# Altium project ADCS C2Sv0.1 - Processor.PrjPcb
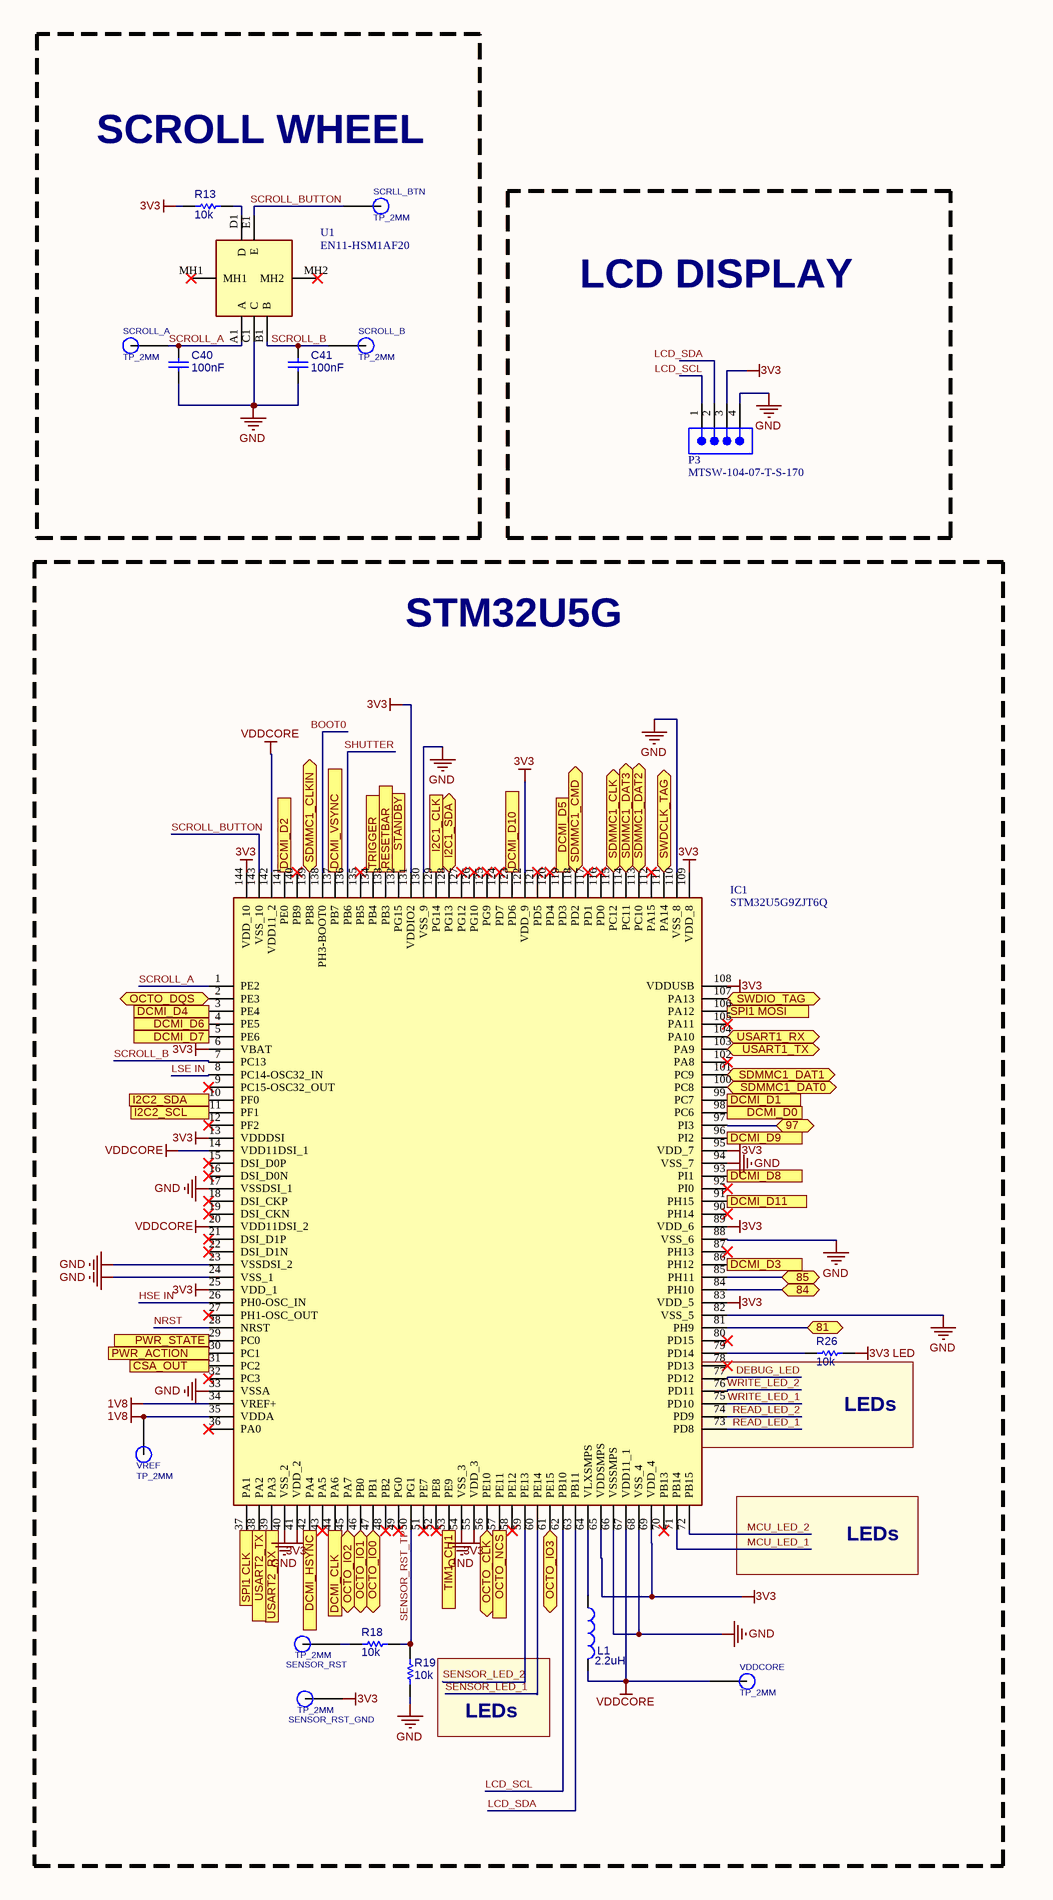
[diagram p0: MCU.SchDoc, left]
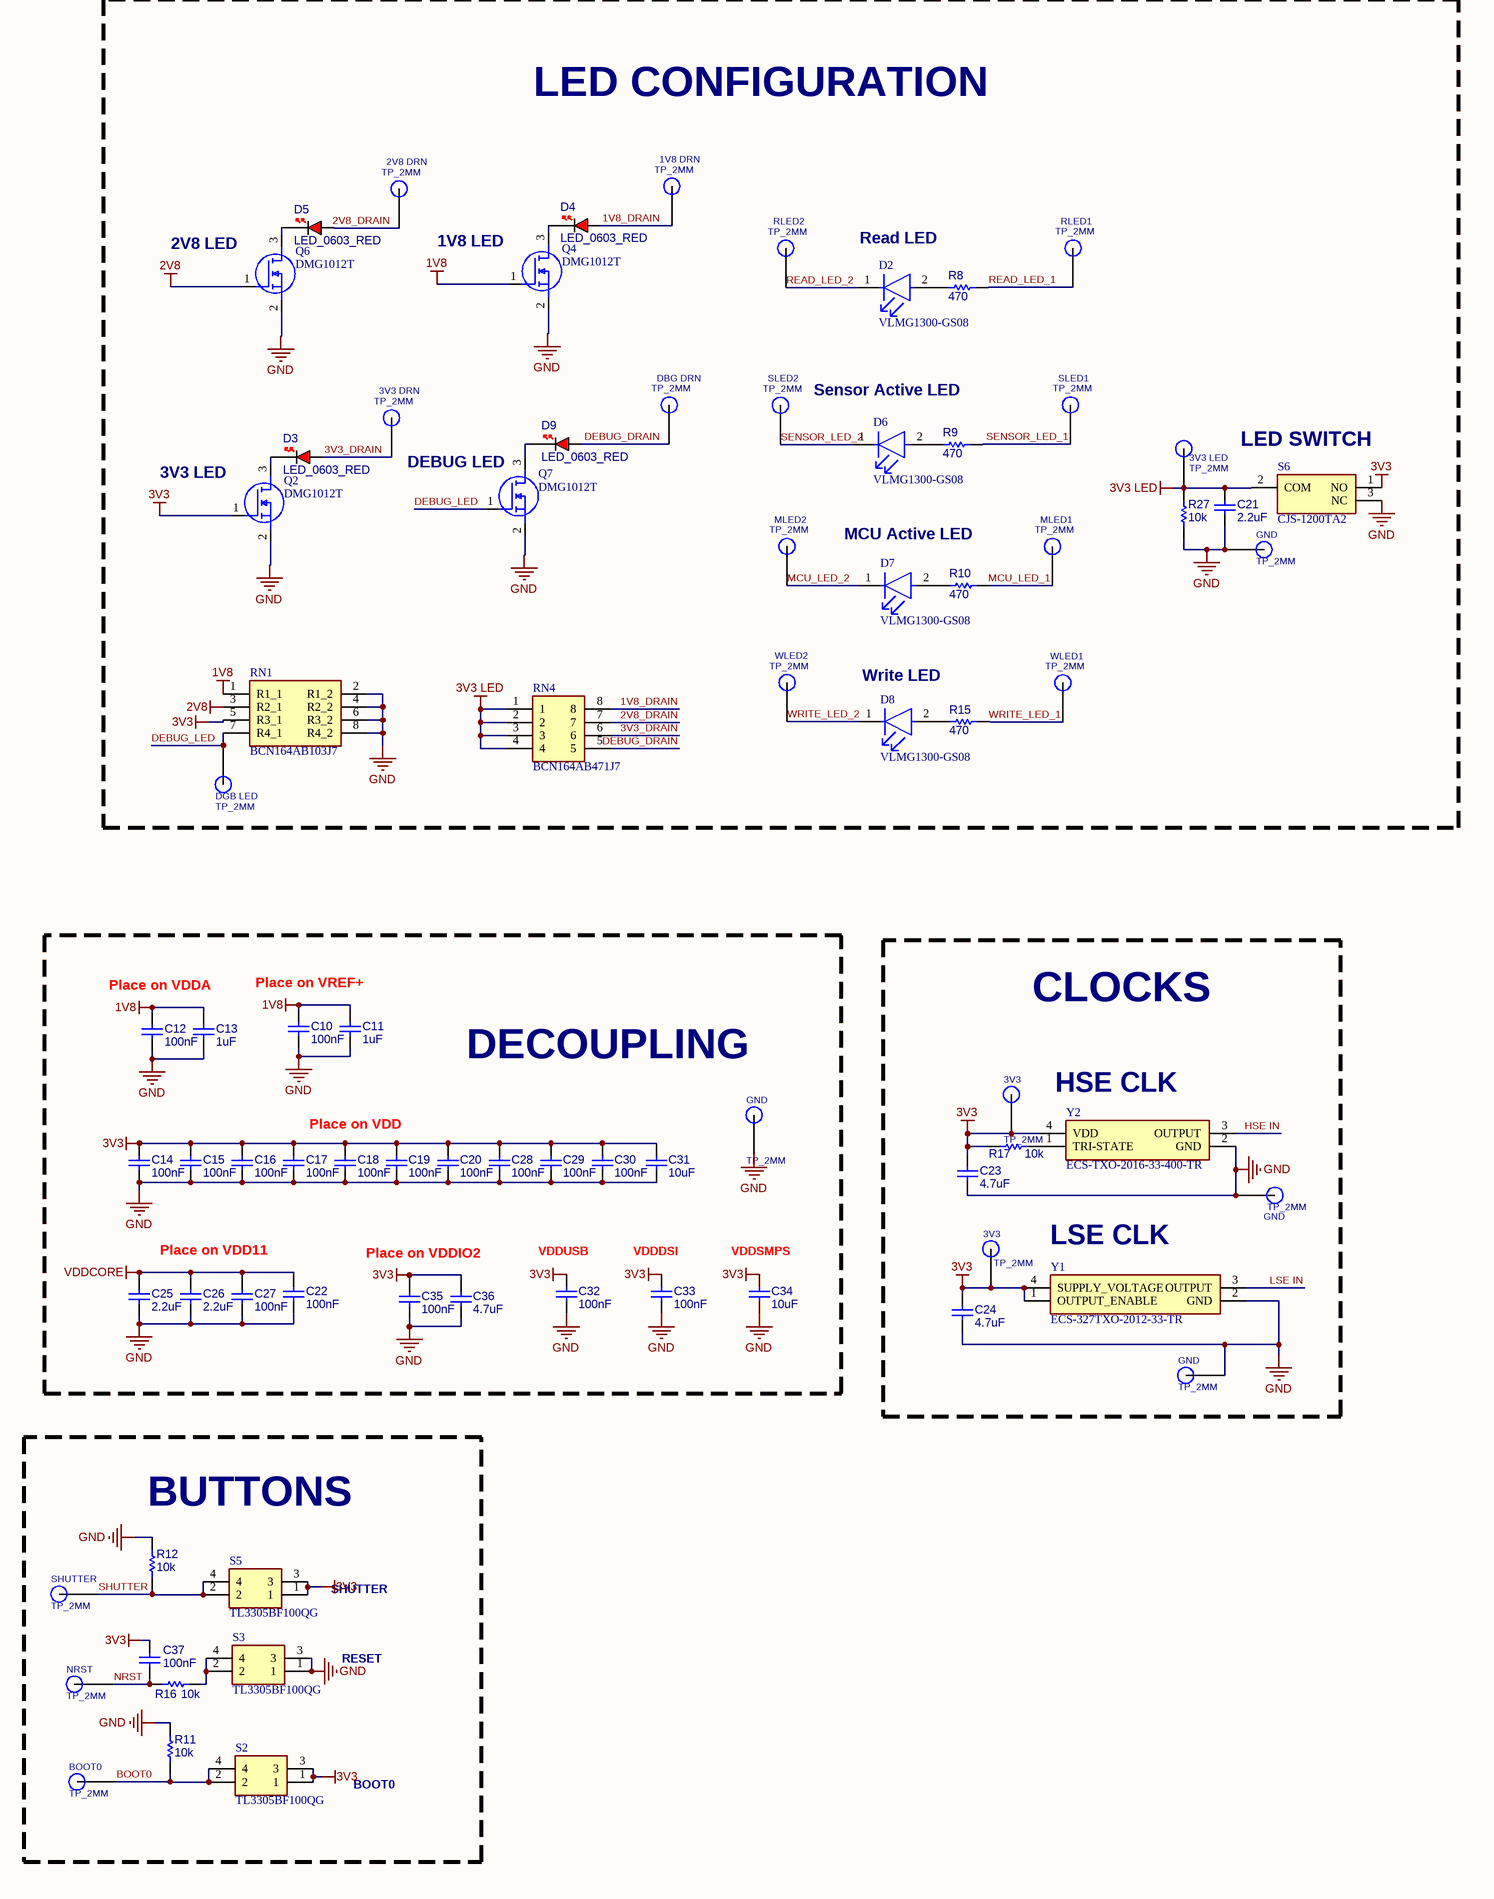
[diagram p1: MCU.SchDoc, right]
3 sheets, 102 parts. Net scope: flat (ports and power ports of the same name join across sheets).
Board file: ADCS C2Sv0.1.PcbDoc
Sheets:
  MCU.SchDoc
  Memory.SchDoc
  TAG.SchDoc

## Sheet MCU.SchDoc
size A2; SheetNumber: 2; SheetTotal: 7

### Parts
(Parts that share a designator on the sheet are numbered #1, #2 ... from top to bottom, then left to right.)
1V8_DRN  TP_2MM  [TESTPOINT 2MM]
2V8_DRN  TP_2MM  [TESTPOINT 2MM]
3V3#1  TP_2MM  [TESTPOINT 2MM]
3V3#2  TP_2MM  [TESTPOINT 2MM]
3V3_DRN  TP_2MM  [TESTPOINT 2MM]
3V3_LED  TP_2MM  [TESTPOINT 2MM]
BOOT0  TP_2MM  [TESTPOINT 2MM]
C10  value 100nF  [C0603]  (hidden comment: MCD-00237)
C11  value 1uF  [C0603]  (hidden comment: MCD-00237)
C12  value 100nF  [C0603]  (hidden comment: MCD-00237)
C13  value 1uF  [C0603]  (hidden comment: MCD-00237)
C14  value 100nF  [C0603]  (hidden comment: MCD-00237)
C15  value 100nF  [C0603]  (hidden comment: MCD-00237)
C16  value 100nF  [C0603]  (hidden comment: MCD-00237)
C17  value 100nF  [C0603]  (hidden comment: MCD-00237)
C18  value 100nF  [C0603]  (hidden comment: MCD-00237)
C19  value 100nF  [C0603]  (hidden comment: MCD-00237)
C20  value 100nF  [C0603]  (hidden comment: MCD-00237)
C21  value 2.2uF  [C0603]  (hidden comment: MCD-00237)
C22  value 100nF  [C0603]  (hidden comment: MCD-00237)
C23  value 4.7uF  [C0603]  (hidden comment: MCD-00237)
C24  value 4.7uF  [C0603]  (hidden comment: MCD-00237)
C25  value 2.2uF  [C0603]  (hidden comment: MCD-00237)
C26  value 2.2uF  [C0603]  (hidden comment: MCD-00237)
C27  value 100nF  [C0603]  (hidden comment: MCD-00237)
C28  value 100nF  [C0603]  (hidden comment: MCD-00237)
C29  value 100nF  [C0603]  (hidden comment: MCD-00237)
C30  value 100nF  [C0603]  (hidden comment: MCD-00237)
C31  value 10uF  [C0603]  (hidden comment: MCD-00237)
C32  value 100nF  [C0603]  (hidden comment: MCD-00237)
C33  value 100nF  [C0603]  (hidden comment: MCD-00237)
C34  value 10uF  [C0603]  (hidden comment: MCD-00237)
C35  value 100nF  [C0603]  (hidden comment: MCD-00237)
C36  value 4.7uF  [C0603]  (hidden comment: MCD-00237)
C37  value 100nF  [C0603]  (hidden comment: MCD-00237)
C40  value 100nF  [C0603]  (hidden comment: MCD-00237)
C41  value 100nF  [C0603]  (hidden comment: MCD-00237)
D2  VLMG1300-GS08  [FP-6_541-5092_01-4-MFG]
D3  LED_0603_RED  [LED_0603_RED]
D4  LED_0603_RED  [LED_0603_RED]
D5  LED_0603_RED  [LED_0603_RED]
D6  VLMG1300-GS08  [FP-6_541-5092_01-4-MFG]
D7  VLMG1300-GS08  [FP-6_541-5092_01-4-MFG]
D8  VLMG1300-GS08  [FP-6_541-5092_01-4-MFG]
D9  LED_0603_RED  [LED_0603_RED]
DBG_DRN  TP_2MM  [TESTPOINT 2MM]
DGB_LED  TP_2MM  [TESTPOINT 2MM]
GND#1  TP_2MM  [TESTPOINT 2MM]
GND#2  TP_2MM  [TESTPOINT 2MM]
GND#3  TP_2MM  [TESTPOINT 2MM]
GND#4  TP_2MM  [TESTPOINT 2MM]
IC1  STM32U5G9ZJT6Q  [QFP50P2200X2200X160-144N]
L1  2.2uH  [INDC1608X90X30LL10T20]
MLED1  TP_2MM  [TESTPOINT 2MM]
MLED2  TP_2MM  [TESTPOINT 2MM]
NRST  TP_2MM  [TESTPOINT 2MM]
P3  MTSW-104-07-T-S-170  [SMTC-MTSW-104-07-X-S-170]
Q2  DMG1012T  [SOT50P160X90-3N]
Q4  DMG1012T  [SOT50P160X90-3N]
Q6  DMG1012T  [SOT50P160X90-3N]
Q7  DMG1012T  [SOT50P160X90-3N]
R8  value 470  [RESC1608X55X25ML10T15-1]  (hidden comment: Resistor 10k +/-1% 0603 100mW)
R9  value 470  [RESC1608X55X25ML10T15-1]  (hidden comment: Resistor 10k +/-1% 0603 100mW)
R10  value 470  [RESC1608X55X25ML10T15-1]  (hidden comment: Resistor 10k +/-1% 0603 100mW)
R11  value 10k  [RESC1608X55X25ML10T15-1]  (hidden comment: Resistor 10k +/-1% 0603 100mW)
R12  value 10k  [RESC1608X55X25ML10T15-1]  (hidden comment: Resistor 10k +/-1% 0603 100mW)
R13  value 10k  [RESC1608X55X25ML10T15-1]  (hidden comment: Resistor 10k +/-1% 0603 100mW)
R15  value 470  [RESC1608X55X25ML10T15-1]  (hidden comment: Resistor 10k +/-1% 0603 100mW)
R16  value 10k  [RESC1608X55X25ML10T15-1]  (hidden comment: Resistor 10k +/-1% 0603 100mW)
R17  value 10k  [RESC1608X55X25ML10T15-1]  (hidden comment: Resistor 10k +/-1% 0603 100mW)
R18  value 10k  [RESC1608X55X25ML10T15-1]  (hidden comment: Resistor 10k +/-1% 0603 100mW)
R19  value 10k  [RESC1608X55X25ML10T15-1]  (hidden comment: Resistor 10k +/-1% 0603 100mW)
R26  value 10k  [RESC1608X55X25ML10T15-1]  (hidden comment: Resistor 10k +/-1% 0603 100mW)
R27  value 10k  [RESC1608X55X25ML10T15-1]  (hidden comment: Resistor 10k +/-1% 0603 100mW)
RLED1  TP_2MM  [TESTPOINT 2MM]
RLED2  TP_2MM  [TESTPOINT 2MM]
RN1  BCN164AB103J7  [BCN164AB103J7]
RN4  BCN164AB471J7  [BCN164AB471J7]
S2  TL3305BF100QG  [TL3305BF100QG]
S3  TL3305BF100QG  [TL3305BF100QG]
S5  TL3305BF100QG  [TL3305BF100QG]
S6  CJS-1200TA2  [CJS1200TA2]
SCRLL_BTN  TP_2MM  [TESTPOINT 2MM]
SCROLL_A  TP_2MM  [TESTPOINT 2MM]
SCROLL_B  TP_2MM  [TESTPOINT 2MM]
SENSOR_RST  TP_2MM  [TESTPOINT 2MM]
SENSOR_RST_GND  TP_2MM  [TESTPOINT 2MM]
SHUTTER  TP_2MM  [TESTPOINT 2MM]
SLED1  TP_2MM  [TESTPOINT 2MM]
SLED2  TP_2MM  [TESTPOINT 2MM]
U1  EN11-HSM1AF20  [EN11HSM1AF20]
VDDCORE  TP_2MM  [TESTPOINT 2MM]
VREF  TP_2MM  [TESTPOINT 2MM]
WLED1  TP_2MM  [TESTPOINT 2MM]
WLED2  TP_2MM  [TESTPOINT 2MM]
Y1  ECS-327TXO-2012-33-TR  [ECS327TXO201233TR]
Y2  ECS-TXO-2016-33-400-TR  [ECS-TXO-2016-33-400-TR]

### Blocks framed on the sheet
SCROLL WHEEL: C40 C41 R13 SCRLL_BTN SCROLL_A SCROLL_B U1
LED CONFIGURATION: 1V8_DRN 2V8_DRN 3V3_DRN 3V3_LED C21 D2-D9 DBG_DRN DGB_LED GND#1 MLED1 MLED2 Q2 Q4 Q6 Q7 R8-R10 R15 R27 RLED1 RLED2 RN1 RN4 S6 SLED1 SLED2 WLED1 WLED2
LCD DISPLAY: P3
STM32U5G: IC1 L1 R18 R19 R26 SENSOR_RST SENSOR_RST_GND VDDCORE VREF
DECOUPLING: C10-C20 C22 C25-C36 GND#2
CLOCKS: 3V3#1 3V3#2 C23 C24 GND#3 GND#4 R17 Y1 Y2
BUTTONS: BOOT0 C37 NRST R11 R12 R16 S2 S3 S5 SHUTTER

### Ports
81 (bidir), 84 (bidir), 85 (bidir), 97 (bidir), CSA_OUT (in), DCMI_CLK (in), DCMI_D0 (in), DCMI_D1 (in), DCMI_D2 (in), DCMI_D3 (in), DCMI_D4 (in), DCMI_D5 (in), DCMI_D6 (in), DCMI_D7 (in), DCMI_D8 (in), DCMI_D9 (in), DCMI_D10 (in), DCMI_D11 (in), DCMI_HSYNC (in), DCMI_VSYNC (in), I2C1_CLK (out), I2C1_SDA (bidir), I2C2_SCL, I2C2_SDA, OCTO_CLK (bidir), OCTO_DQS (bidir), OCTO_IO0 (bidir), OCTO_IO1 (bidir), OCTO_IO2 (bidir), OCTO_IO3 (bidir), OCTO_NCS (out), PWR_ACTION (out), PWR_STATE (in), RESETBAR (out), SDMMC1_CLK (bidir), SDMMC1_CLKIN (bidir), SDMMC1_CMD (bidir), SDMMC1_DAT0 (bidir), SDMMC1_DAT1 (bidir), SDMMC1_DAT2 (bidir), SDMMC1_DAT3 (bidir), SPI1 CLK, SPI1 MOSI (out), STANDBY (out), SWDCLK_TAG (bidir), SWDIO_TAG (bidir), TIM1_CH1 (out), TRIGGER (out), USART1_RX (bidir), USART1_TX (bidir), USART2_RX, USART2_TX

### Nets
1V8: C10.1 C11.1 C12.1 C13.1 IC1.34(VREF+) IC1.35(VDDA) Q4.1(G) RN1.1(R1_1) VREF.TP(TP_2MM)
2V8: Q6.1(G) RN1.3(R2_1)
3V3: 3V3#1.TP(TP_2MM) 3V3#2.TP(TP_2MM) C14.1 C15.1 C16.1 C17.1 C18.1 C19.1 C20.1 C23.2 C24.1 C28.1 C29.1 C30.1 C31.1 C32.1 C33.1 C34.1 C35.1 C36.1 C37.1 IC1.6(VBAT) IC1.13(VDDDSI) IC1.25(VDD_1) IC1.41(VDD_2) IC1.55(VDD_3) IC1.65(VDDSMPS) IC1.69(VDD_4) IC1.83(VDD_5) IC1.89(VDD_6) IC1.95(VDD_7) IC1.108(VDDUSB) IC1.109(VDD_8) IC1.122(VDD_9) IC1.131(VDDIO2) IC1.144(VDD_10) P3.3 Q2.1(G) R13.1 R17.1 RN1.5(R3_1) S2.1 S2.3 S5.1 S5.3 S6.1(NO) SENSOR_RST_GND.TP(TP_2MM) Y1.1(OUTPUT_ENABLE) Y1.4(SUPPLY_VOLTAGE) Y2.4(VDD)
3V3 LED: 3V3_LED.TP(TP_2MM) C21.2 R26.1 R27.2 RN4.1 RN4.2 RN4.3 RN4.4 S6.2(COM)
GND: C10.2 C11.2 C12.2 C13.2 C14.2 C15.2 C16.2 C17.2 C18.2 C19.2 C20.2 C21.1 C22.2 C23.1 C24.2 C25.2 C26.2 C27.2 C28.2 C29.2 C30.2 C31.2 C32.2 C33.2 C34.2 C35.2 C36.2 C40.2 C41.2 GND#1.TP(TP_2MM) GND#2.TP(TP_2MM) GND#3.TP(TP_2MM) GND#4.TP(TP_2MM) IC1.17(VSSDSI_1) IC1.23(VSSDSI_2) IC1.24(VSS_1) IC1.33(VSSA) IC1.40(VSS_2) IC1.54(VSS_3) IC1.66(VSSSMPS) IC1.68(VSS_4) IC1.82(VSS_5) IC1.88(VSS_6) IC1.94(VSS_7) IC1.110(VSS_8) IC1.130(VSS_9) P3.4 Q2.2(S) Q4.2(S) Q6.2(S) Q7.2(S) R11.2 R12.2 R19.1 R27.1 RN1.2(R1_2) RN1.4(R2_2) RN1.6(R3_2) RN1.8(R4_2) S3.1 S3.3 S6.3(NC) U1.C1(C) Y1.2(GND) Y2.2(GND)
VDDCORE: C22.1 C25.1 C26.1 C27.1 IC1.14(VDD11DSI_1) IC1.20(VDD11DSI_2) IC1.67(VDD11_1) IC1.142(VDD11_2) L1.2 VDDCORE.TP(TP_2MM)
1V8_DRAIN: 1V8_DRN.TP(TP_2MM) D4.A RN4.8
2V8_DRAIN: 2V8_DRN.TP(TP_2MM) D5.A RN4.7
3V3_DRAIN: 3V3_DRN.TP(TP_2MM) D3.A RN4.6
BOOT0: BOOT0.TP(TP_2MM) IC1.138(PH3-BOOT0) R11.1 S2.2 S2.4
DEBUG_DRAIN: D9.A DBG_DRN.TP(TP_2MM) RN4.5
DEBUG_LED: DGB_LED.TP(TP_2MM) IC1.77(PD12) Q7.1(G) RN1.7(R4_1)
HSE IN: IC1.26(PH0-OSC_IN) Y2.3(OUTPUT)
LCD_SCL: IC1.62(PB10) P3.1
LCD_SDA: IC1.63(PB11) P3.2
LSE IN: IC1.8(PC14-OSC32_IN) Y1.3(OUTPUT)
MCU_LED_1: IC1.71(PB14) MLED1.TP(TP_2MM) R10.2
MCU_LED_2: D7.1(C) IC1.72(PB15) MLED2.TP(TP_2MM)
NRST: C37.2 IC1.28(NRST) NRST.TP(TP_2MM) R16.1
OCTO_CLK: IC1.56(PE10) ; port OCTO_CLK
OCTO_IO0: IC1.47(PB1) ; port OCTO_IO0
OCTO_IO1: IC1.46(PB0) ; port OCTO_IO1
OCTO_IO2: IC1.45(PA7) ; port OCTO_IO2
OCTO_IO3: IC1.61(PE15) ; port OCTO_IO3
READ_LED_1: IC1.73(PD8) R8.1 RLED1.TP(TP_2MM)
READ_LED_2: D2.1(C) IC1.74(PD9) RLED2.TP(TP_2MM)
SCROLL_A: C40.1 IC1.1(PE2) SCROLL_A.TP(TP_2MM) U1.A1(A)
SCROLL_B: C41.1 IC1.7(PC13) SCROLL_B.TP(TP_2MM) U1.B1(B)
SCROLL_BUTTON: IC1.143(VSS_10) SCRLL_BTN.TP(TP_2MM) U1.E1(E)
SENSOR_LED_1: IC1.60(PE14) R9.2 SLED1.TP(TP_2MM)
SENSOR_LED_2: D6.1(C) IC1.59(PE13) SLED2.TP(TP_2MM)
SENSOR_RST_TP: IC1.50(PG1) R18.2 R19.2
SHUTTER: IC1.136(PB6) R12.1 S5.2 S5.4 SHUTTER.TP(TP_2MM)
SWDCLK_TAG: IC1.111(PA14) ; port SWDCLK_TAG
SWDIO_TAG: IC1.107(PA13) ; port SWDIO_TAG
WRITE_LED_1: IC1.75(PD10) R15.2 WLED1.TP(TP_2MM)
WRITE_LED_2: D8.1(C) IC1.76(PD11) WLED2.TP(TP_2MM)
NetD2_2: D2.2(A) R8.2
NetD3_K: D3.K Q2.3(D)
NetD4_K: D4.K Q4.3(D)
NetD5_K: D5.K Q6.3(D)
NetD6_2: D6.2(A) R9.1
NetD7_2: D7.2(A) R10.1
NetD8_2: D8.2(A) R15.1
NetD9_K: D9.K Q7.3(D)
NetIC1_2: IC1.2(PE3) ; port OCTO_DQS
NetIC1_3: IC1.3(PE4) ; port DCMI_D4
NetIC1_4: IC1.4(PE5) ; port DCMI_D6
NetIC1_5: IC1.5(PE6) ; port DCMI_D7
NetIC1_10: IC1.10(PF0) ; port I2C2_SDA
NetIC1_11: IC1.11(PF1) ; port I2C2_SCL
NetIC1_29: IC1.29(PC0) ; port PWR_STATE
NetIC1_30: IC1.30(PC1) ; port PWR_ACTION
NetIC1_31: IC1.31(PC2) ; port CSA_OUT
NetIC1_37: IC1.37(PA1) ; port SPI1 CLK
NetIC1_38: IC1.38(PA2) ; port USART2_TX
NetIC1_39: IC1.39(PA3) ; port USART2_RX
NetIC1_42: IC1.42(PA4) ; port DCMI_HSYNC
NetIC1_44: IC1.44(PA6) ; port DCMI_CLK
NetIC1_53: IC1.53(PE9) ; port TIM1_CH1
NetIC1_57: IC1.57(PE11) ; port OCTO_NCS
NetIC1_64: IC1.64(VLXSMPS) L1.1
NetIC1_79: IC1.79(PD14) R26.2
NetIC1_81: IC1.81(PH9) ; port 81
NetIC1_84: IC1.84(PH10) ; port 84
NetIC1_85: IC1.85(PH11) ; port 85
NetIC1_86: IC1.86(PH12) ; port DCMI_D3
NetIC1_91: IC1.91(PH15) ; port DCMI_D11
NetIC1_93: IC1.93(PI1) ; port DCMI_D8
NetIC1_96: IC1.96(PI2) ; port DCMI_D9
NetIC1_97: IC1.97(PI3) ; port 97
NetIC1_98: IC1.98(PC6) ; port DCMI_D0
NetIC1_99: IC1.99(PC7) ; port DCMI_D1
NetIC1_100: IC1.100(PC8) ; port SDMMC1_DAT0
NetIC1_101: IC1.101(PC9) ; port SDMMC1_DAT1
NetIC1_103: IC1.103(PA9) ; port USART1_TX
NetIC1_104: IC1.104(PA10) ; port USART1_RX
NetIC1_106: IC1.106(PA12) ; port SPI1 MOSI
NetIC1_113: IC1.113(PC10) ; port SDMMC1_DAT2
NetIC1_114: IC1.114(PC11) ; port SDMMC1_DAT3
NetIC1_115: IC1.115(PC12) ; port SDMMC1_CLK
NetIC1_118: IC1.118(PD2) ; port SDMMC1_CMD
NetIC1_119: IC1.119(PD3) ; port DCMI_D5
NetIC1_123: IC1.123(PD6) ; port DCMI_D10
NetIC1_128: IC1.128(PG13) ; port I2C1_SDA
NetIC1_129: IC1.129(PG14) ; port I2C1_CLK
NetIC1_132: IC1.132(PG15) ; port STANDBY
NetIC1_133: IC1.133(PB3) ; port RESETBAR
NetIC1_134: IC1.134(PB4) ; port TRIGGER
NetIC1_137: IC1.137(PB7) ; port DCMI_VSYNC
NetIC1_139: IC1.139(PB8) ; port SDMMC1_CLKIN
NetIC1_141: IC1.141(PE0) ; port DCMI_D2
NetR13_2: R13.2 U1.D1(D)
NetR16_2: R16.2 S3.2 S3.4
NetR17_2: R17.2 Y2.1(TRI-STATE)
NetR18_1: R18.1 SENSOR_RST.TP(TP_2MM)

Not connected (* = marked no-connect by the designer): IC1 9(PC15-OSC32_OUT)* 12(PF2)* 15(DSI_D0P)* 16(DSI_D0N)* 18(DSI_CKP)* 19(DSI_CKN)* 21(DSI_D1P)* 22(DSI_D1N)* 27(PH1-OSC_OUT)* 32(PC3)* 36(PA0)* 43(PA5)* 48(PB2)* 49(PG0)* 51(PE7)* 52(PE8)* 58(PE12)* 70(PB13)* 78(PD13)* 80(PD15)* 87(PH13)* 90(PH14)* 92(PI0)* 102(PA8)* 105(PA11)* 112(PA15)* 116(PD0)* 117(PD1)* 120(PD4)* 121(PD5)* 124(PD7)* 125(PG9)* 126(PG10)* 127(PG12)* 135(PB5)* 140(PB9)*; U1 MH1* MH2*

### Notes on the sheet
- (near Q6) 2V8 LED
- (near Q4) 1V8 LED
- Read LED
- Sensor Active LED
- (near Q7) DEBUG LED
- LED SWITCH
- (near Q2) 3V3 LED
- MCU Active LED
- Write LED
- Place on VDDA
- Place on VREF+
- Place on VDD
- HSE CLK
- Place on VDD11
- Place on VDDIO2
- (near C32) VDDUSB
- (near C33) VDDDSI
- (near C34) VDDSMPS
- (near Y1) LSE CLK
- (near R26) LEDs
- LEDs
- SHUTTER
- RESET
- BOOT0

### Library data of the parts
C10-C37 C40 C41 = CMP-112-000001-1: Capacitor, MLCC, 100nF, 6V3, X5R, 10%, 0603, T=0,8mm; Manufacturer Part Number: CC0603KRX5R5BB104; Manufacturer: YAGEO; ECCN_EU: NEC; Provided_By: SUBCO; ECCN_US: EAR99; Status: Released; ComponentLink1Description: Datasheet; Component Type: Capacitors; Pin Count: 2; Package: C0603; Source: MB1364.SCHLIB; Design Item ID: MCD-00237; Part_Type: Capacitor; Internal_Part_Number: MCD-00237; ComponentLink1URL: http://tunmcdsvn.tun.st.com/Component_Datasheet_Library/Trunk/Capacitors/Yageo_Multilayer_capacitor_X5R_series_100pF_to_100uF; Manufacturer_Part_Number: CC0603KRX5R5BB104
D2 D6-D8 = CMP-02520-000011-1: LED GREEN 0603 SMD; Manufacturer: Vishay; Peak Emmision Wavelength: 574nm; Power Dissipation: 75mW; Viewing Angle: 130°; Reverse Voltage: 5V; Led Orientation: Top View; Forward Current: 20mA; Colour: Yellow Green; Forward Voltage: 2V; Luminous Intensity: 35mcd; Wavelength: 571nm; Height: 1mm; Mouser Description: LED; SMD; 0603; yellow green; 18-35mcd; 1.6x0.8x0.8mm; 130°; 2÷2.4V; Category: Diode; Temperature: -35°C to +85°C; Ambient Temperature Range Low: -35°C; Package: 6.541-5092.01-4; RoHS: TRUE; Device Class L2: LEDs; ComponentLink2Description: Datasheet; Device Class L3: unset; Octopart: https://octopart.com/vlmg1300-gs08-vishay-21709199; Device Class L1: Optoelectronics; Temperature Range Low: -35°C; Manufacturer Part Number: VLMG1300-GS08; Automotive: No; Lead Free: Yes; Ambient Temperature Range High: +85°C; Digikey Description: LED GREEN 0603 SMD; Temperature Range High: +85°C; ComponentLink2URL: http://www.vishay.com/docs/82437/vlmo1300.pdf
D3-D5 D9 = CMP-007-000026-1: LED 0603 RED SMD; Design Item ID: LED_0603_RED; Source: Schematic-Lib-PhilsLab.SchLib
IC1 = STM32U5G9ZJT6Q: Integrated Circuit; Manufacturer_Name: STMicroelectronics; Datasheet Link: https://www.st.com/resource/en/datasheet/stm32u5g7vj.pdf; Height: 1.6mm; Manufacturer_Part_Number: STM32U5G9ZJT6Q; Mouser Part Number: 511-STM32U5G9ZJT6Q; Mouser Price/Stock: https://www.mouser.co.uk/ProductDetail/STMicroelectronics/STM32U5G9ZJT6Q?qs=pBunHO6%252BwtHTKyjOWi%252Btmg%3D%3D; Arrow Part Number: STM32U5G9ZJT6Q; Arrow Price/Stock: https://www.arrow.com/en/products/stm32u5g9zjt6q/stmicroelectronics?utm_currency=USD&region=nac
L1 = CMP-2000-05913-1: Unshielded Wirewound Inductor, 33 nH, 350 mA, -55 to 150 degC, 0603 (1608 Metric), RoHS, Tape and Reel; Manufacturer: EPCOS-(TDK); Q @ Freq: 14@100MHz; Inductance: 33nH; Material - Core: Ceramic; Frequency - Self Resonant: 3GHz; DC Resistance (DCR): 600mOhmMax; Tolerance: ±5%; Frequency - Test: 100MHz; Current Rating: 350mA; Manufacturer URL: http://www.tdk.com/; Type: Wirewound; Mounting Type: SurfaceMount; Mounting Technology: SurfaceMount; Height - Seated (Max): 0.035"(0.90mm); Datasheet URL: https://en.tdk.eu/inf/30/db/ind_2008/b82496c.pdf; Shielding: Unshielded; Operating Temperature: -; Size / Dimension: 0.063"Lx0.031"W(1.60mmx0.80mm); Series: SIMID; Current - Saturation: -; Ratings: AEC-Q200; Packaging: CutTape(CT); Package Reference: 0603; Datasheet Version: 07/2016; Category: Inductors,Coils,Chokes; Package Description: 2-Pin Surface Mount Device, Body 1.6 x 0.8 mm; Family: FixedInductors; Package / Case: 0603(1608Metric)
P3 = CMP-1024-00105-1: Modified .025" SQ Post Header, Through-hole, Vertical, -55 to 105 degC, 2.54 mm Pitch, 4-Pin, Male, RoHS; Manufacturer: Samtec; Pitch: 2.54 mm; PartNumber: MTSW-104-07-T-S-170; ComponentLink3Description: Package Specification; ComponentLink2URL: http://www.samtec.com/documents/webfiles/pdf/MTSW.PDF; Temperature Range: -55 to 105 degC; DatasheetVersion: F-214; ComponentLink3URL: http://www.samtec.com/documents/webfiles/cpdf/MTSW-XXX-XX-X-X-XXXX-XX-XXX-MKT1.pdf; Orientation: Vertical; ComponentLink1URL: http://www.samtec.com; RoHS: True; PackageReference: MTSW-104-07-X-S-170; ComponentLink1Description: Manufacturer URL; Mounting Technology: Through-hole; PackageDescription: Assembly .025" [.64] SQ Post Terminal Strip; PackageVersion: BI, 2/1987; ComponentLink2Description: Datasheet
Q2 Q4 Q6 Q7 = DMG1012T: MOSFET (N-Channel); Manufacturer_Name: Diodes Incorporated; Datasheet Link: https://www.diodes.com/datasheet/download/DMG1012T.pdf; Height: 0.9mm; Manufacturer_Part_Number: DMG1012T; Mouser Part Number: N/A; Mouser Price/Stock: https://www.mouser.co.uk/ProductDetail/Diodes-Incorporated/DMG1012T?qs=Wj%2FVkw3K%252BMD5naxckZUW%2FA%3D%3D
R8-R13 R15-R19 R26 R27 = CMP-009-00181-1: Chip Resistor, 10k Ohm, 0.1 W, -55 to 155 degC, 0603 (1608 Metric); Voltage Rating: 50V; Tolerance: 1%; Source: Components - 14.11.22 - 11.28.SchLib; Design Item ID: CMP-009-00006-5; Created by: Micah Randall; Power: 100mW; Max Operating Temperature: 155°C; RoHS Compliant: Yes; Mounting Technology: SM; Case/Package: 0603; Min Operating Temperature: -55°C; Pins: 2
RN1 = BCN164AB103J7: Resistor Network; Manufacturer_Name: IRC / TT Electronics; Datasheet Link: https://componentsearchengine.com/Datasheets/1/BCN164AB103J7.pdf; Height: 0.6mm; Manufacturer_Part_Number: BCN164AB103J7; Mouser Part Number: 858-BCN164AB103J7; Mouser Price/Stock: https://www.mouser.co.uk/ProductDetail/IRC-TT-Electronics/BCN164AB103J7?qs=sKpblPcrDFAYmBHclHBIlw%3D%3D; Arrow Part Number: BCN164AB103J7; Arrow Price/Stock: https://www.arrow.com/en/products/bcn164ab103j7/irc
RN4 = BCN164AB471J7: Resistor Network; Manufacturer_Name: TT Electronics; Datasheet Link: https://www.mouser.com/datasheet/2/414/BCN-1154942.pdf; Height: 0.6mm; Manufacturer_Part_Number: BCN164AB471J7; Mouser Part Number: 858-BCN164AB471J7
S2 S3 S5 = TL3305BF100QG: Switch; Manufacturer_Name: E-Switch; Datasheet Link: https://configured-product-images.s3.amazonaws.com/2D/specs/TL3305BF100QG.pdf; Manufacturer_Part_Number: TL3305BF100QG; Mouser Part Number: 612-TL3305BF100QG; Mouser Price/Stock: https://www.mouser.co.uk/ProductDetail/E-Switch/TL3305BF100QG?qs=IKkN%2F947nfDIPwqPQja%252BvQ%3D%3D
S6 = CJS-1200TA2: Switch; Manufacturer_Name: Nidec Copal; Datasheet Link: http://www.nidec-copal-electronics.com/j/catalog/switch/cjs.pdf; Height: 2.5mm; Manufacturer_Part_Number: CJS-1200TA2; Mouser Part Number: 229-CJS-1200TA2; Mouser Price/Stock: https://www.mouser.co.uk/ProductDetail/Nidec-Components/CJS-1200TA2?qs=XeJtXLiO41Rf26ws0igWdA%3D%3D
U1 = EN11-HSM1AF20: Undefined or Miscellaneous; Manufacturer_Name: TT Electronics; Datasheet Link: https://datasheet.datasheetarchive.com/originals/distributors/Datasheets_SAMA/2e239bccdca13b9604c0057335e160d7.pdf; Height: 27.1mm; Manufacturer_Part_Number: EN11-HSM1AF20; Mouser Part Number: 858-EN11-HSM1AF20; Mouser Price/Stock: https://www.mouser.co.uk/ProductDetail/BI-Technologies-TT-Electronics/EN11-HSM1AF20?qs=%252BUYXD5bnyXqPYOUPwiF4VA%3D%3D
Y1 = ECS-327TXO-2012-33-TR: Crystal or Oscillator; Manufacturer_Name: ECS; Datasheet Link: https://ecsxtal.com/store/pdf/ECS-327TXO-2012.pdf; Height: 1.2mm; Manufacturer_Part_Number: ECS-327TXO-2012-33-TR; Mouser Part Number: 520-327TXO-2012-33TR; Mouser Price/Stock: https://www.mouser.co.uk/ProductDetail/ECS/ECS-327TXO-2012-33-TR?qs=amGC7iS6iy%252Bnhf6zW2Y7hQ%3D%3D; Arrow Part Number: ECS-327TXO-2012-33-TR; Arrow Price/Stock: https://www.arrow.com/en/products/ecs-327txo-2012-33-tr/ecs-international?utm_currency=USD&region=nac
Y2 = ECS-TXO-2016-33-400-TR: Crystal or Oscillator; Manufacturer_Name: ECS; Datasheet Link: https://datasheet.datasheetarchive.com/originals/distributors/Datasheets_SAMA/fdc451124f6f80954f29114af1256858.pdf; Height: 0.8mm; Manufacturer_Part_Number: ECS-TXO-2016-33-400-TR; Mouser Part Number: 520-TXO-2016-33-400T; Mouser Price/Stock: https://www.mouser.co.uk/ProductDetail/ECS/ECS-TXO-2016-33-400-TR?qs=PzGy0jfpSMtctR53CPxRHg%3D%3D; Arrow Part Number: ECS-TXO-2016-33-400-TR; Arrow Price/Stock: https://www.arrow.com/en/products/ecs-txo-2016-33-400-tr/ecs-international?region=nac

## Sheet Memory.SchDoc
size A4; SheetNumber: 3; SheetTotal: 7
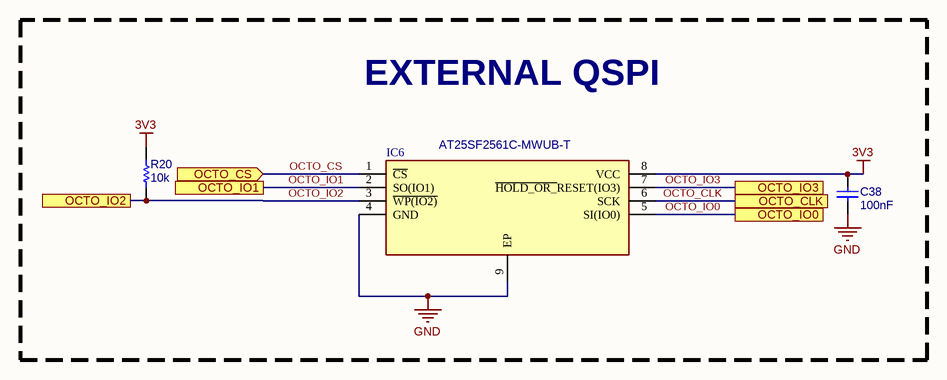
[diagram p2: Memory.SchDoc]

### Parts
C38  value 100nF  [C0603]  (hidden comment: MCD-00237)
IC6  AT25SF2561C-MWUB-T  [SON127P800X600X80-9N-D]
R20  value 10k  [RESC1608X55X25ML10T15-1]  (hidden comment: Resistor 10k +/-1% 0603 100mW)

### Blocks framed on the sheet
EXTERNAL QSPI: C38 IC6 R20

### Ports
OCTO_CLK, OCTO_CS (in), OCTO_IO0, OCTO_IO1, OCTO_IO2, OCTO_IO3

### Nets
3V3: C38.1 IC6.8(VCC) R20.2
GND: C38.2 IC6.4(GND) IC6.9(EP)
OCTO_CLK: IC6.6(SCK) ; port OCTO_CLK
OCTO_CS: IC6.1(~{CS}) ; port OCTO_CS
OCTO_IO0: IC6.5(SI(IO0)) ; port OCTO_IO0
OCTO_IO1: IC6.2(SO(IO1)) ; port OCTO_IO1
OCTO_IO2: IC6.3(~{WP(IO2)}) R20.1 ; port OCTO_IO2
OCTO_IO3: IC6.7(~{HOLD_OR_}RESET(IO3)) ; port OCTO_IO3

### Library data of the parts
C38 = CMP-112-000001-1: as C10 on sheet MCU; Status: Released; ComponentLink1Description: Datasheet; Component Type: Capacitors; Pin Count: 2; Package: C0603; Source: MB1364.SCHLIB; Design Item ID: MCD-00237; Part_Type: Capacitor; Internal_Part_Number: MCD-00237; ComponentLink1URL: http://tunmcdsvn.tun.st.com/Component_Datasheet_Library/Trunk/Capacitors/Yageo_Multilayer_capacitor_X5R_series_100pF_to_100uF; Manufacturer_Part_Number: CC0603KRX5R5BB104
IC6 = AT25SF2561C-MWUB-T: Integrated Circuit; Manufacturer_Name: Renesas Electronics; Datasheet Link: https://www.renesas.com/us/en/products/memory-logic/non-volatile-memory/spi-nor-flash/at25sf2561c-256mbit-3v-spi-serial-flash-memory-single-dual-quad-io-qpi-and-dtr-support; Height: 0.8mm; Manufacturer_Part_Number: AT25SF2561C-MWUB-T
R20 = CMP-009-00181-1: as R8 on sheet MCU; Source: Components - 14.11.22 - 11.28.SchLib; Design Item ID: CMP-009-00006-5; Created by: Micah Randall; Power: 100mW; Max Operating Temperature: 155°C; RoHS Compliant: Yes; Mounting Technology: SM; Case/Package: 0603; Min Operating Temperature: -55°C; Pins: 2

## Sheet TAG.SchDoc
size A4; SheetNumber: 7; SheetTotal: 7
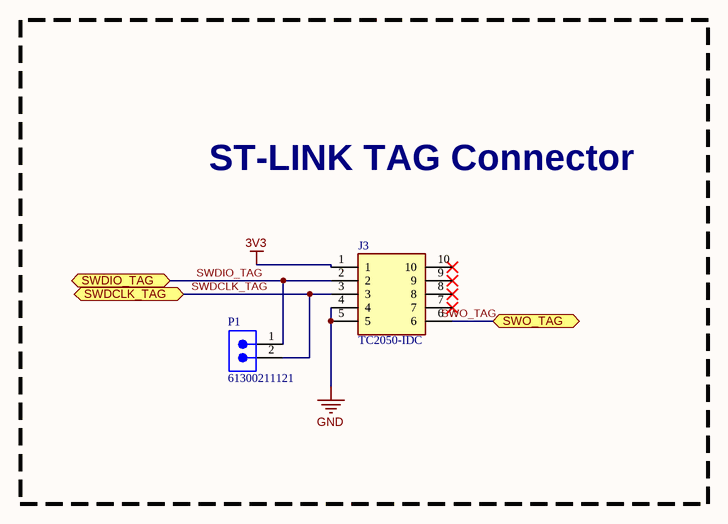
[diagram p3: TAG.SchDoc]

### Parts
J3  TC2050-IDC  [TC2050-IDC]
P1  61300211121  [61300211121]

### Blocks framed on the sheet
ST-LINK TAG Connector: J3 P1

### Ports
SWDCLK_TAG (bidir), SWDIO_TAG (bidir), SWO_TAG (bidir)

### Nets
3V3: J3.1
GND: J3.4 J3.5
SWDCLK_TAG: J3.3 P1.2 ; port SWDCLK_TAG
SWDIO_TAG: J3.2 P1.1 ; port SWDIO_TAG
SWO_TAG: J3.6 ; port SWO_TAG

Not connected (* = marked no-connect by the designer): J3 7* 8* 9* 10*

### Library data of the parts
J3 = TC2050-IDC: Connector; Manufacturer_Name: Tag Connect; Datasheet Link: https://datasheet.datasheetarchive.com/originals/distributors/Datasheets_SAMA/51f607a36a24a0aceedaa5d6ebc30014.pdf; Manufacturer_Part_Number: TC2050-IDC
P1 = CMP-096-000133-1: WR-PHD Pin Header, THT, Vertical, pitch 2.54mm, 1 Row, 2P; Manufacturer: Wurth Elektronik; Working Voltage: 250V; Contact Resistance: 20mOhm; Rated Current: 3A; Withstanding Voltage: 500V; Orientation: Vertical; Number of Rows: 1; Match Code: WR-PHD; Pin Count: 2; Gender: Pin Header; Source: WR-PHD.SchLib; Packaging: Bag; Manufacturer Part Number: 61300211121; Operating Temperature Min: -40°C; Component Type: Standard; ComponentLink1URL: https://www.we-online.com/redexpert/article/61300211121?ad; Pitch: 2.54mm; Mount: Through Hole; ComponentLink1Description: Website Link; ComponentLink2Description: Datasheet Link; Number of Pins: 2; Category: Board-to-Board Connectors; Design Item ID: 61300211121; ComponentLink2URL: https://www.we-online.com/redexpert/spec/61300211121?ad; Operating Temperature Max: 105°C

## Nets that join several sheets
3V3: MCU (50 pins), Memory (C38.1 IC6.8 R20.2), TAG (J3.1)
GND: MCU (65 pins), Memory (C38.2 IC6.4 IC6.9), TAG (J3.4 J3.5)
OCTO_CLK: MCU (IC1.56), Memory (IC6.6)
OCTO_IO0: MCU (IC1.47), Memory (IC6.5)
OCTO_IO1: MCU (IC1.46), Memory (IC6.2)
OCTO_IO2: MCU (IC1.45), Memory (IC6.3 R20.1)
OCTO_IO3: MCU (IC1.61), Memory (IC6.7)
SWDCLK_TAG: MCU (IC1.111), TAG (J3.3 P1.2)
SWDIO_TAG: MCU (IC1.107), TAG (J3.2 P1.1)